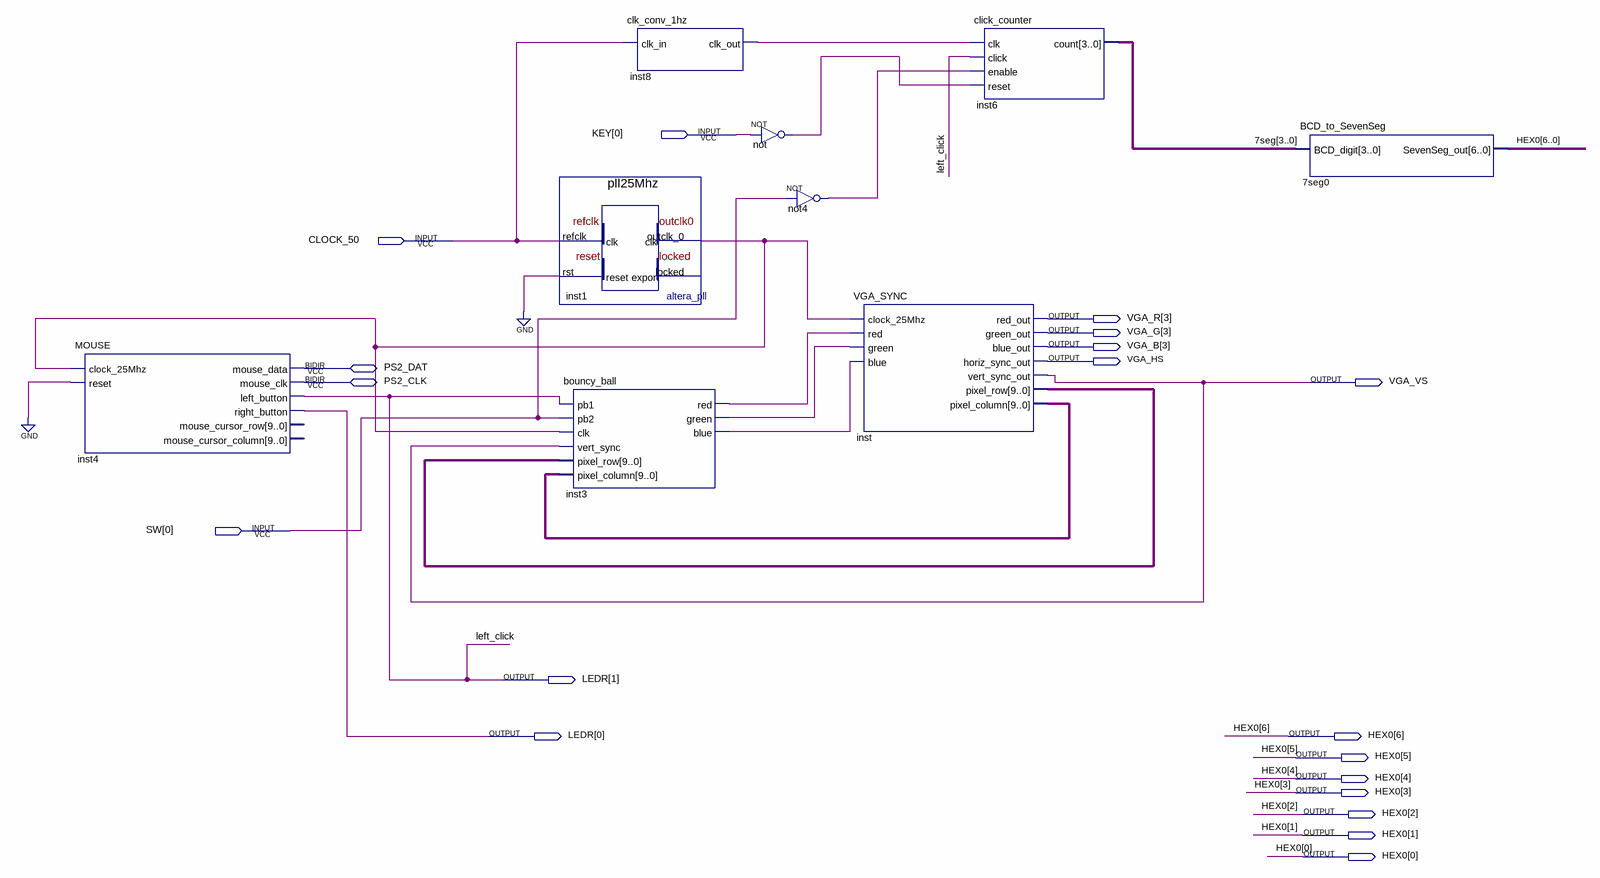
[diagram p0: schematic sheet]
// Quartus schematic vga_tester.bdf as structural Verilog: 9 symbols, 19 pins
module vga_tester (
  input  [0:0] KEY,
  input  CLOCK_50,
  input  [0:0] SW,
  inout  PS2_DAT,
  inout  PS2_CLK,
  output [3:3] VGA_R,
  output [3:3] VGA_G,
  output [3:3] VGA_B,
  output VGA_HS,
  output VGA_VS,
  output [1:0] LEDR,
  output [6:0] HEX0
);

  wire inst1_outclk_0, inst3_blue, inst3_green, inst3_red, inst8_clk_out, not4_out, not_out;
  wire [3:0] \7seg ;
  wire [9:0] inst_pixel_column, inst_pixel_row;

  MOUSE inst4 (
    .clock_25Mhz(inst1_outclk_0), .reset(1'b0), .left_button(LEDR[1]), .right_button(LEDR[0]),
    .mouse_data(PS2_DAT), .mouse_clk(PS2_CLK));  // open: mouse_cursor_row, mouse_cursor_column
  pll25Mhz inst1 (.refclk(CLOCK_50), .rst(1'b0), .outclk_0(inst1_outclk_0));  // open: locked
  bouncy_ball inst3 (
    .pb1(LEDR[1]), .pb2(SW[0]), .clk(inst1_outclk_0), .vert_sync(VGA_VS), .pixel_row(inst_pixel_row),
    .pixel_column(inst_pixel_column), .red(inst3_red), .green(inst3_green), .blue(inst3_blue));
  clk_conv_1hz inst8 (.clk_in(CLOCK_50), .clk_out(inst8_clk_out));
  not \not  (not_out, KEY[0]);
  not not4 (not4_out, SW[0]);
  VGA_SYNC inst (
    .clock_25Mhz(inst1_outclk_0), .red(inst3_red), .green(inst3_green), .blue(inst3_blue),
    .red_out(VGA_R[3]), .green_out(VGA_G[3]), .blue_out(VGA_B[3]), .horiz_sync_out(VGA_HS),
    .vert_sync_out(VGA_VS), .pixel_row(inst_pixel_row), .pixel_column(inst_pixel_column));
  click_counter inst6 (.clk(inst8_clk_out), .click(LEDR[1]), .enable(not4_out), .reset(not_out), .count(\7seg ));
  BCD_to_SevenSeg u_7seg0 (.BCD_digit(\7seg ), .SevenSeg_out(HEX0));

  // Other names for the same wires on the sheet: left_click = LEDR[1]
endmodule
